# Altium schematic sheet PWR.SchDoc
size A4; SheetNumber: 1; SheetTotal: 3
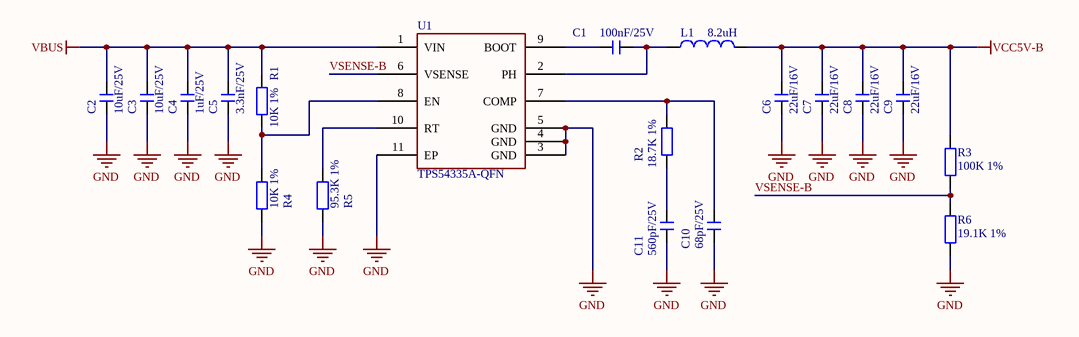
[diagram p0: PWR.SchDoc]

## Parts
C1  100nF/25V  [C0402_L]
C2  10uF/25V  [C0603_L]
C3  10uF/25V  [C0603_L]
C4  1uF/25V  [C0603_L]
C5  3.3nF/25V  [C0603_L]
C6  22uF/16V  [C0603_L]
C7  22uF/16V  [C0603_L]
C8  22uF/16V  [C0603_L]
C9  22uF/16V  [C0603_L]
C10  68pF/25V  [C0402_L]
C11  560pF/25V  [C0402_L]
L1  8.2uH  [NR4020]
R1  10K 1%  [R0402_L]
R2  18.7K 1%  [R0402_L]
R3  100K 1%  [R0402_L]
R4  10K 1%  [R0402_L]
R5  95.3K 1%  [R0402_L]
R6  19.1K 1%  [R0402_L]
U1  TPS54335A-QFN  [VSON-10_L3.0-W3.0-P0.50-TL-EP]

## Nets
GND: C2.1 C3.1 C4.1 C5.1 C6.1 C7.1 C8.1 C9.1 C10.1 C11.1 R4.2 R5.2 R6.2 U1.3(GND) U1.4(GND) U1.5(GND) U1.11(EP)
VBUS: C2.2 C3.2 C4.2 C5.2 R1.1 U1.1(VIN)
VCC5V-B: C6.2 C7.2 C8.2 C9.2 L1.2 R3.1
VSENSE-B: R3.2 R6.1 U1.6(VSENSE)
NetC1_1: C1.1 L1.1 U1.2(PH)
NetC1_2: C1.2 U1.9(BOOT)
NetC10_2: C10.2 R2.1 U1.7(COMP)
NetC11_2: C11.2 R2.2
NetR1_2: R1.2 R4.1 U1.8(EN)
NetR5_1: R5.1 U1.10(RT)

## Library data of the parts
C1-C11 = C: 无极性贴片电容; 版权归属: 源创客; 材质: X7R; BOM名称: 无极性贴片电容; 学习资源: www.ooocke.com
L1 = L: 小功率贴片电感; 版权归属: 源创客; BOM名称: 小功率贴片电感; 学习资源: www.ooocke.com
R1-R6 = R: 贴片电阻; 版权归属: 源创客; BOM名称: 贴片电阻; 学习资源: www.ooocke.com
U1 = TPS54335A-QFN: BUCK